# EAGLE design node4 (EAGLE 5.10)
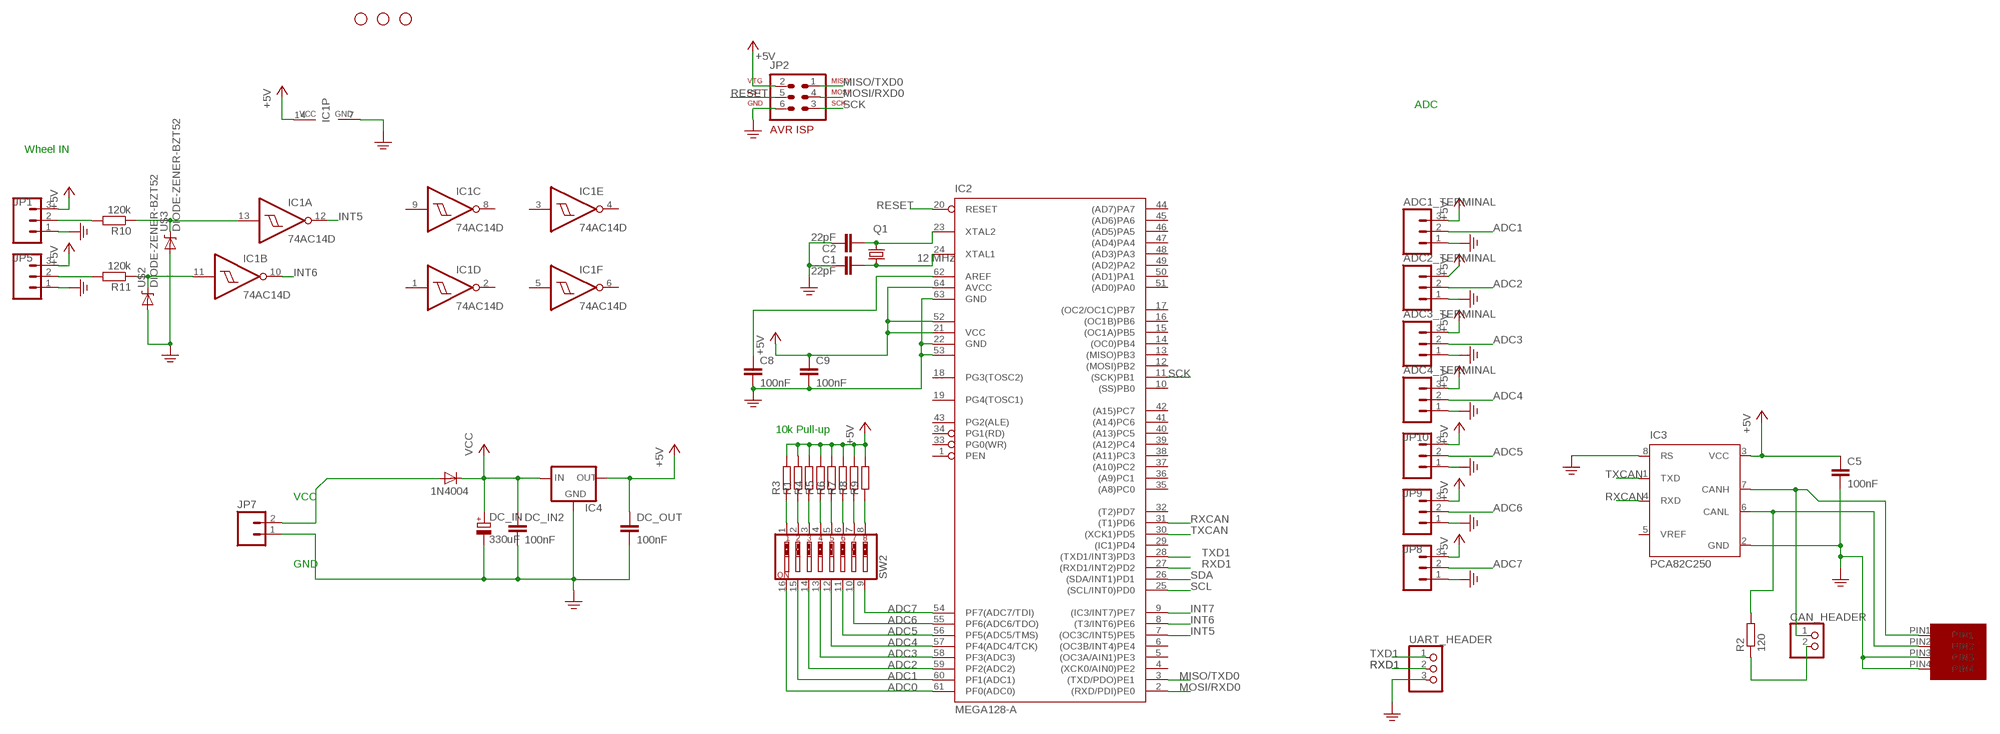
[diagram p0: schematic, sheet 1]

## Parts
ADC1_TERMINAL  M03SCREW  [SCREWTERMINAL-3.5MM-3]
ADC2_TERMINAL  M03SCREW  [SCREWTERMINAL-3.5MM-3]
ADC3_TERMINAL  M03SCREW  [SCREWTERMINAL-3.5MM-3]
ADC4_TERMINAL  M03SCREW  [SCREWTERMINAL-3.5MM-3]
C1  22pF  C5/2.5  [C5B2.5]
C2  22pF  C5/2.5  [C5B2.5]
C5  100nF  C-EU050-024X044  [C050-024X044]
C8  100nF  C-EU050-024X044  [C050-024X044]
C9  100nF  C-EU050-024X044  [C050-024X044]
CAN_HEADER  PINHD-1X2  [1X02]
DC_IN  330uF  CPOL-EUE15-5AXIAL  [E15-5]
DC_IN2  100nF  C-EU050-024X044  [C050-024X044]
DC_OUT  100nF  C-EU050-024X044  [C050-024X044]
ENSRET  1N4004  [DO41-10]
IC1  74AC14D  [SO14]
IC2  MEGA128-A  [TQFP64]
IC3  PCA82C250  [DIL08]
IC4  V_REG_78XXSIDE  [78XXL]
JP1  M03  [S3B-PH]
JP2  AVR-ISP-6  [AVR-ISP-6]
JP3  STAND-OFF  [STAND-OFF]
JP4  STAND-OFF  [STAND-OFF]
JP5  M03  [S3B-PH]
JP6  STAND-OFF  [STAND-OFF]
JP7  M02-JST-2MM-SMT  [S2B-PH]
JP8  M03  [S3B-PH]
JP9  M03  [S3B-PH]
JP10  M03  [S3B-PH]
Q1  12 MHz  CRYSTALHC49U70  [HC49U70]
R1  R-EU_R0603  [R0603]
R2  120  R-EU_R0603  [R0603]
R3  R-EU_R0603  [R0603]
R4  R-EU_R0603  [R0603]
R5  R-EU_R0603  [R0603]
R6  R-EU_R0603  [R0603]
R7  R-EU_R0603  [R0603]
R8  R-EU_R0603  [R0603]
R9  R-EU_R0603  [R0603]
R10  120k  R-EU_R0603  [R0603]
R11  120k  R-EU_R0603  [R0603]
SW2  SW_DIP-8  [DIPSWITCH-08]
U$1  MICROFIT4  [MICROFIT4SOCK]
U$2  DIODE-ZENER-BZT52  [SOD-323]
U$3  DIODE-ZENER-BZT52  [SOD-323]
UART_HEADER  PINHD-1X3  [1X03]

## Nets
+5V: ADC1_TERMINAL.3 ADC2_TERMINAL.3 ADC3_TERMINAL.3 ADC4_TERMINAL.3 C5.1 C9.1 DC_OUT.1 IC1.14(P:VCC) IC2.21(VCC) IC2.52(VCC1) IC2.64(AVCC) IC3.3(VCC) IC4.OUT JP1.3 JP2.2 JP5.3 JP8.3 JP9.3 JP10.3 R1.2 R3.2 R4.2 R5.2 R6.2 R7.2 R8.2 R9.2
ADC0: IC2.61(PF0(ADC0)) SW2.16
ADC1: ADC1_TERMINAL.2 IC2.60(PF1(ADC1)) SW2.15
ADC2: ADC2_TERMINAL.2 IC2.59(PF2(ADC2)) SW2.14
ADC3: ADC3_TERMINAL.2 IC2.58(PF3(ADC3)) SW2.13
ADC4: ADC4_TERMINAL.2 IC2.57(PF4(ADC4/TCK)) SW2.12
ADC5: IC2.56(PF5(ADC5/TMS)) JP10.2 SW2.11
ADC6: IC2.55(PF6(ADC6/TDO)) JP9.2 SW2.10
ADC7: IC2.54(PF7(ADC7/TDI)) JP8.2 SW2.9
CANJUMP1: CAN_HEADER.1 IC3.7(CANH) U$1.PIN1
CANJUMP2: CAN_HEADER.2 R2.1
INT5: IC1.12(A:O) IC2.7((OC3C/INT5)PE5)
INT6: IC1.10(B:O) IC2.8((T3/INT6)PE6)
INT7: IC2.9((IC3/INT7)PE7)
MISO/TXD0: IC2.3((TXD/PDO)PE1) JP2.1
MOSI/RXD0: IC2.2((RXD/PDI)PE0) JP2.4
N$1: C1.2 IC2.24(XTAL1) Q1.1
N$2: C2.2 IC2.23(XTAL2) Q1.2
N$3: R1.1 SW2.2
N$4: R3.1 SW2.1
N$5: ENSRET.A JP7.2
N$7: R4.1 SW2.3
N$8: JP5.2 R11.2
N$9: JP1.2 R10.2
N$10: C8.1 IC2.62(AREF)
N$12: IC1.11(B:I) R11.1 U$2.1(C)
N$13: IC1.13(A:I) R10.1 U$3.1(C)
N$14: R5.1 SW2.4
N$15: R6.1 SW2.5
N$16: R7.1 SW2.6
N$17: R8.1 SW2.7
N$20: R9.1 SW2.8
N$51: IC3.6(CANL) R2.2 U$1.PIN2
PE: ADC1_TERMINAL.1 ADC2_TERMINAL.1 ADC3_TERMINAL.1 ADC4_TERMINAL.1 C1.1 C2.1 C5.2 C8.2 C9.2 DC_IN2.2 DC_IN.- DC_OUT.2 IC1.7(P:GND) IC2.22(GND) IC2.53(GND1) IC2.63(GND) IC3.2(GND) IC3.8(RS) IC4.GND JP1.1 JP2.6 JP5.1 JP7.1 JP8.1 JP9.1 JP10.1 U$1.PIN3 U$1.PIN4 U$2.2(A) U$3.2(A) UART_HEADER.3
RESET: IC2.20(RESET) JP2.5
RXCAN: IC2.31((T1)PD6) IC3.4(RXD)
RXD1: IC2.27((RXD1/INT2)PD2) UART_HEADER.2
SCK: IC2.11((SCK)PB1) JP2.3
SCL: IC2.25((SCL/INT0)PD0)
SDA: IC2.26((SDA/INT1)PD1)
TXCAN: IC2.30((XCK1)PD5) IC3.1(TXD)
TXD1: IC2.28((TXD1/INT3)PD3) UART_HEADER.1
VCC: DC_IN2.1 DC_IN.+ ENSRET.C IC4.IN
Unconnected: IC1.1(D:I) IC1.2(D:O) IC1.3(E:I) IC1.4(E:O) IC1.5(F:I) IC1.6(F:O) IC1.8(C:O) IC1.9(C:I) IC2.1(PEN) IC2.4((XCK0/AIN0)PE2) IC2.5((OC3A/AIN1)PE3) IC2.6((OC3B/INT4)PE4) IC2.10((SS)PB0) IC2.12((MOSI)PB2) IC2.13((MISO)PB3) IC2.14((OC0)PB4) IC2.15((OC1A)PB5) IC2.16((OC1B)PB6) IC2.17((OC2/OC1C)PB7) IC2.18(PG3(TOSC2)) IC2.19(PG4(TOSC1)) IC2.29((IC1)PD4) IC2.32((T2)PD7) IC2.33(PG0(WR)) IC2.34(PG1(RD)) IC2.35((A8)PC0) IC2.36((A9)PC1) IC2.37((A10)PC2) IC2.38((A11)PC3) IC2.39((A12)PC4) IC2.40((A13)PC5) IC2.41((A14)PC6) IC2.42((A15)PC7) IC2.43(PG2(ALE)) IC2.44((AD7)PA7) IC2.45((AD6)PA6) IC2.46((AD5)PA5) IC2.47((AD4)PA4) IC2.48((AD3)PA3) IC2.49((AD2)PA2) IC2.50((AD1)PA1) IC2.51((AD0)PA0) IC3.5(VREF)

## Notes on the sheet
- ADC
- Wheel IN
- 10k Pull-up
- VCC
- GND

## Library data of the parts
ADC1_TERMINAL ADC2_TERMINAL ADC3_TERMINAL ADC4_TERMINAL = SparkFun:M03: Header 3 Standard 3-pin 0.1" header. Use with straight break away headers (SKU : PRT-00116), right angle break away headers (PRT-00553), swiss pins (PRT-00743), machine pins (PRT-00117), and female headers (PRT-00115). Molex polarized connector foot print use with SKU : PRT-08232 with associated crimp pins and housings.
C1 C2 = capacitor-wima:C: CAPACITOR naming: grid - package width
C5 C8 C9 DC_IN2 DC_OUT = rcl:C-EU: CAPACITOR, European symbol
CAN_HEADER = pinhead:PINHD-1X2: PIN HEADER
DC_IN = rcl:CPOL-EU: POLARIZED CAPACITOR, European symbol
ENSRET = diode:1N4004: DIODE general purpose rectifier, 1 A
IC1 = 74xx-eu:74*14: Hex schmitt trigger INVERTER
IC2 = atmel:MEGA128: MICROCONTROLLER 128 Kbytes FLASH 4 Kbytes SRAM 4 Kbytes EEPROM DUAL USART 8-channel 10 bit ADC Source: avr.lbr
IC3 = micro-philips:PCA82C250: CAN CONTROLLER INTERFACE
IC4 = SparkFun:V_REG_78XX: Voltage Regulator Standard 7805 5V regulator. IGO (Input Ground Output). Spark Fun Electronics SKU : COM-00107
JP1 JP5 JP8-JP10 = unicorn_v2:M03: Header 2 Standard 2-pin 0.1" header. Use with straight break away headers (SKU : PRT-00116), right angle break away headers (PRT-00553), swiss pins (PRT-00743), machine pins (PRT-00117), and female headers (PRT-00115). Molex polarized connector foot print use with SKU : PRT-08233 with associated crimp pins and housings.
JP2 = avr-5:AVR-ISP-6: AVR ISP-6 Serial Programming Header
JP3 JP4 JP6 = SparkFun:STAND-OFF: Stand Off This is the mechanical footprint for a #4 phillips button head screw. Use the keepout ring to avoid running the screw head into surrounding components. SKU : PRT-00447
JP7 = unicorn_v2:M02: Header 2 Standard 2-pin 0.1" header. Use with straight break away headers (SKU : PRT-00116), right angle break away headers (PRT-00553), swiss pins (PRT-00743), machine pins (PRT-00117), and female headers (PRT-00115). Molex polarized connector foot print use with SKU : PRT-08233 with associated crimp pins and housings.
Q1 = crystal:CRYSTAL: CRYSTAL
R1-R11 = resistor:R-EU_: RESISTOR, European symbol
SW2 = SparkFun:SW_DIP-8: DIP Switch 8 Position Spark Fun Electronics SKU : COM-08034
U$1 = UNICORN:MICROFIT4
U$2 U$3 = SparkFun:DIODE-ZENER: Zener Diode Production Part - 8199 3.4V Zener Voltage
UART_HEADER = pinhead:PINHD-1X3: PIN HEADER

## Board
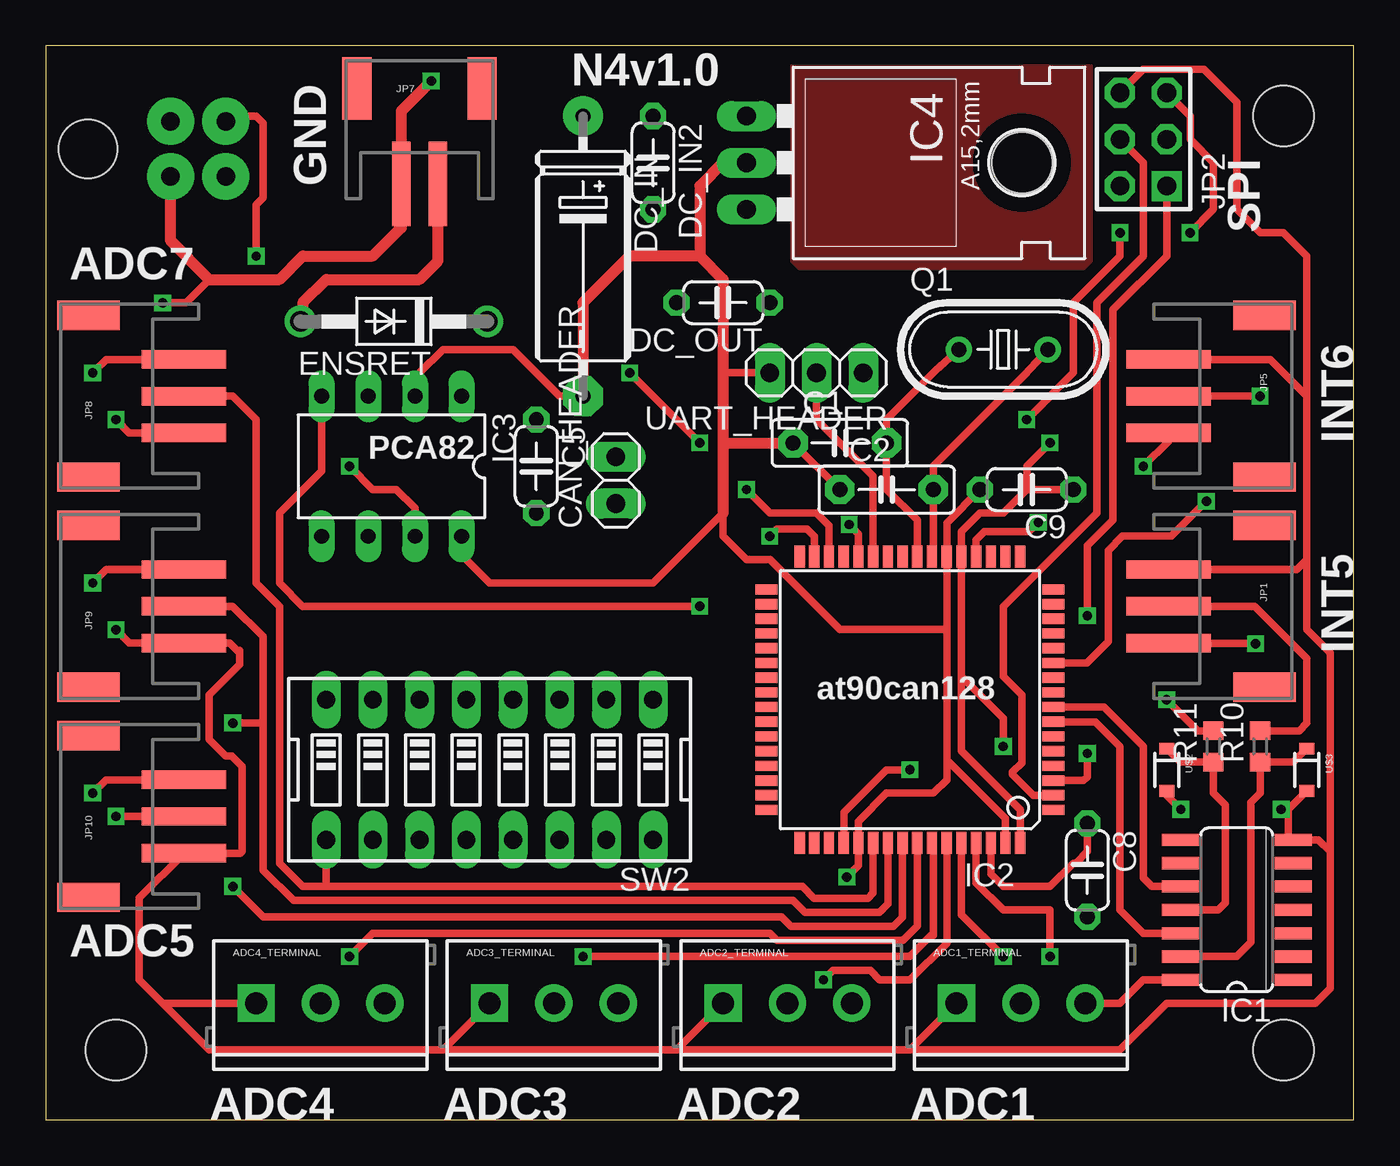
[diagram p1: board, top side]
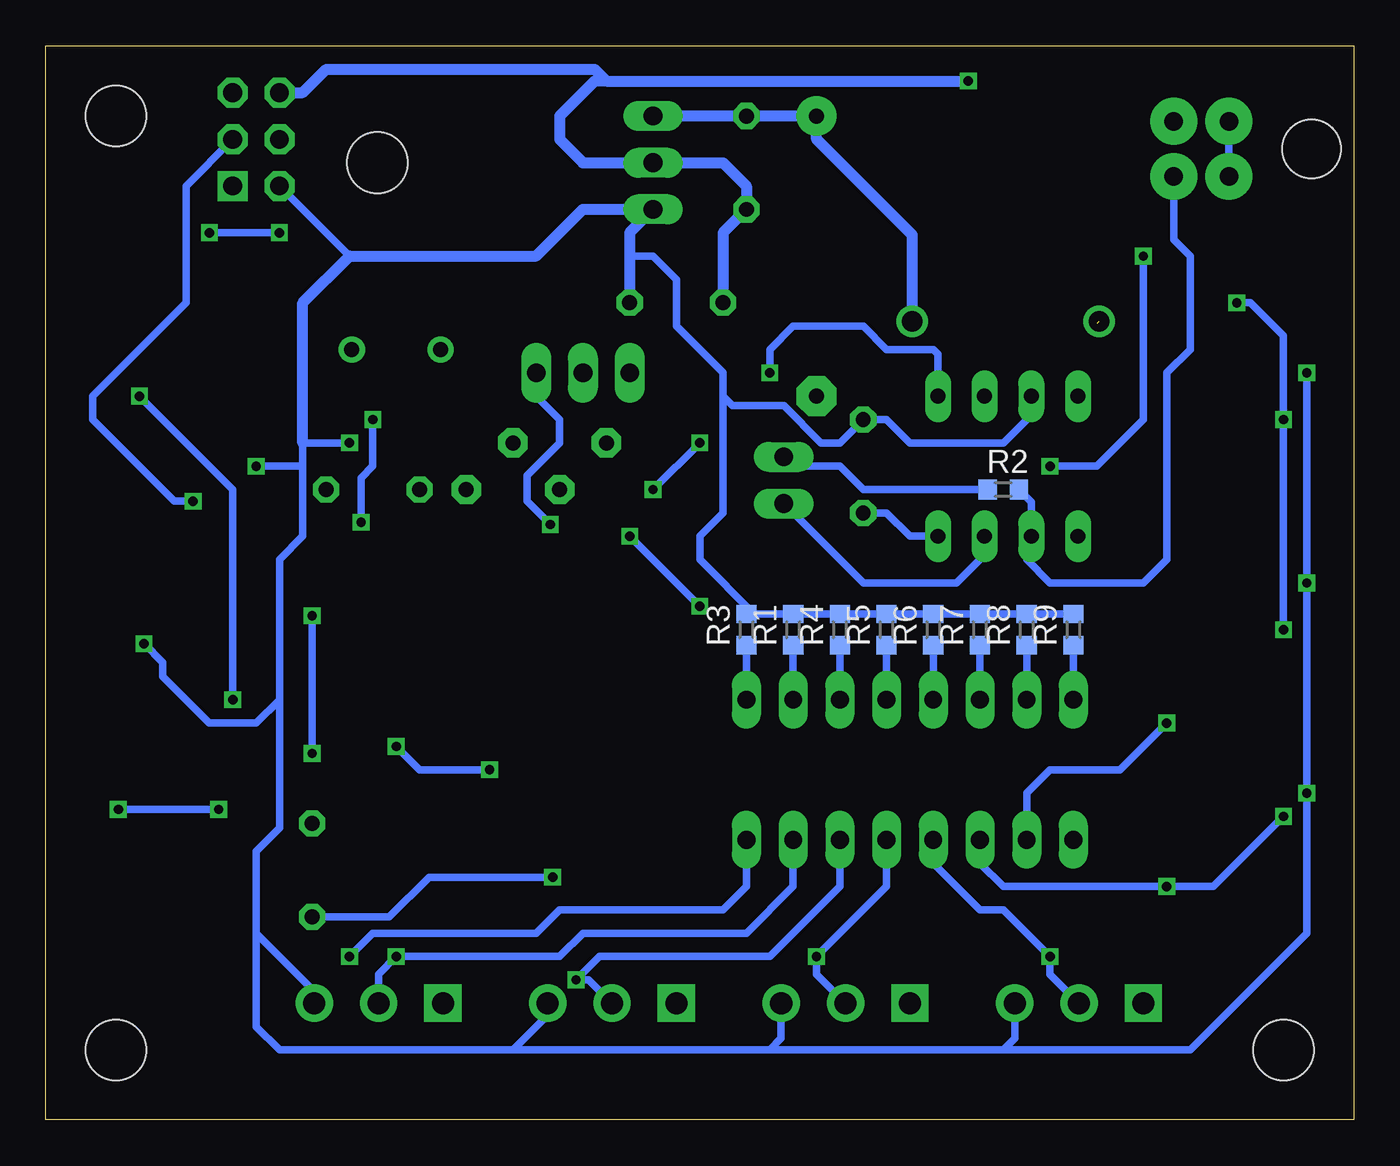
[diagram p2: board, bottom side, seen from below]

Size 71.12 x 58.42 mm. Coordinates in mm from the lower left corner, seen from the top.
Outline: 0,0 71.12,0 71.12,58.42 0,58.42 0,0
Copper layers (1*16): Top 0.035mm / dielectric 1.5mm / Bottom 0.035mm
Design rules "default *": minimum track width 12mil, minimum drill 24mil, track to track 12mil, track to pad 12mil, pad to pad 8mil, via to via 8mil, smd to smd 8mil, copper to edge 40mil, drill to drill 8mil, minimum pad ring 12mil, minimum via ring 8mil, stop-mask expansion 4mil, vias tented up to drill 0mil, thermal gap 10mil

### Footprints (pad centres in the part's own frame; a part is rotated, then mirrored left to right if it is on the bottom)
SCREWTERMINAL-3.5MM-3 = drill 1.2 pad 2.032 square: 1 0,0 | drill 1.2 pad 2.032 round: 2 3.5,0; 3 7,0
C5B2.5 = drill 0.813 pad 1.6 octagon: 1 -2.54,0; 2 2.54,0
C050-024X044 = drill 0.813 octagon: 1 -2.54,0; 2 2.54,0
1X02 = drill 1.016 long: 1 -1.27,0; 2 1.27,0
E15-5 = drill 0.813 pad 2.159 round: + -7.62,0 | drill 0.813 pad 2.159 octagon: - 7.62,0
DO41-10 = drill 1.118 round: A 5.08,0; C -5.08,0
SO14 = smd 0.66 x 2.032: 1 -3.81,-3.073; 2 -2.54,-3.073; 3 -1.27,-3.073; 4 0,-3.073; 5 1.27,-3.073; 6 2.54,-3.073; 7 3.81,-3.073; 8 3.81,3.073; 9 2.54,3.073; 10 1.27,3.073; 11 0,3.073; 12 -1.27,3.073; 13 -2.54,3.073; 14 -3.81,3.073
TQFP64 = smd 1.194 x 0.559: 1 -7.8,6; 2 -7.8,5.2; 3 -7.8,4.4; 4 -7.8,3.6; 5 -7.8,2.8; 6 -7.8,2; 7 -7.8,1.2; 8 -7.8,0.4; 9 -7.8,-0.4; 10 -7.8,-1.2; 11 -7.8,-2; 12 -7.8,-2.8; 13 -7.8,-3.6; 14 -7.8,-4.4; 15 -7.8,-5.2; 16 -7.8,-6; 33 7.8,-6; 34 7.8,-5.2; 35 7.8,-4.4; 36 7.8,-3.6; 37 7.8,-2.8; 38 7.8,-2; 39 7.8,-1.2; 40 7.8,-0.4; 41 7.8,0.4; 42 7.8,1.2; 43 7.8,2; 44 7.8,2.8; 45 7.8,3.6; 46 7.8,4.4; 47 7.8,5.2; 48 7.8,6 | smd 0.559 x 1.194: 17 -6,-7.8; 18 -5.2,-7.8; 19 -4.4,-7.8; 20 -3.6,-7.8; 21 -2.8,-7.8; 22 -2,-7.8; 23 -1.2,-7.8; 24 -0.4,-7.8; 25 0.4,-7.8; 26 1.2,-7.8; 27 2,-7.8; 28 2.8,-7.8; 29 3.6,-7.8; 30 4.4,-7.8; 31 5.2,-7.8; 32 6,-7.8; 49 6,7.8; 50 5.2,7.8; 51 4.4,7.8; 52 3.6,7.8; 53 2.8,7.8; 54 2,7.8; 55 1.2,7.8; 56 0.4,7.8; 57 -0.4,7.8; 58 -1.2,7.8; 59 -2,7.8; 60 -2.8,7.8; 61 -3.6,7.8; 62 -4.4,7.8; 63 -5.2,7.8; 64 -6,7.8
DIL08 = drill 0.813 long: 1 -3.81,-3.81; 2 -1.27,-3.81; 3 1.27,-3.81; 4 3.81,-3.81; 5 3.81,3.81; 6 1.27,3.81; 7 -1.27,3.81; 8 -3.81,3.81
78XXL = drill 1.016 long: GND 0,-3.81; IN -2.54,-3.81; OUT 2.54,-3.81 | hole 3.302: 0,11.176
S3B-PH = smd 1 x 4.6: 1 -2,-2.43; 2 0,-2.43; 3 2,-2.43 | smd 1.6 x 3.4: NC1 -4.4,2.77; NC2 4.4,2.77
AVR-ISP-6 = drill 1.016 square: 1 -2.54,-1.27 | drill 1.016 octagon: 2 -2.54,1.27; 3 0,-1.27; 4 0,1.27; 5 2.54,-1.27; 6 2.54,1.27
STAND-OFF = hole 3.302: 0,0
S2B-PH = smd 1 x 4.6: 1 -1,-3.7; 2 1,-3.7 | smd 1.6 x 3.4: NC1 -3.4,1.5; NC2 3.4,1.5
HC49U70 = drill 0.813 round: 1 -2.413,0; 2 2.413,0
R0603 = smd 1 x 1.1: 1 -0.85,0; 2 0.85,0
DIPSWITCH-08 = drill 0.97 long: 1 -8.89,-3.81; 2 -6.35,-3.81; 3 -3.81,-3.81; 4 -1.27,-3.81; 5 1.27,-3.81; 6 3.81,-3.81; 7 6.35,-3.81; 8 8.89,-3.81; 9 8.89,3.81; 10 6.35,3.81; 11 3.81,3.81; 12 1.27,3.81; 13 -1.27,3.81; 14 -3.81,3.81; 15 -6.35,3.81; 16 -8.89,3.81
MICROFIT4SOCK = drill 1 pad 2.54 round: PIN1 -2,0; PIN2 1,0; PIN3 -2,-3; PIN4 1,-3 | hole 3.2: -0.5,-7.5
SOD-323 = smd 0.63 x 0.83: 1 -1.15,0; 2 1.15,0
1X03 = drill 1.016 long: 1 -2.54,0; 2 0,0; 3 2.54,0

### Placement (x,y rotation side)
ADC1_TERMINAL  49.53,6.35 0 top
ADC2_TERMINAL  36.83,6.35 0 top
ADC3_TERMINAL  24.13,6.35 0 top
ADC4_TERMINAL  11.43,6.35 0 top
C1  43.18,36.83 0 top
C2  45.72,34.29 0 top
C5  26.67,35.56 270 top
C8  56.64,13.59 270 top
C9  53.34,34.29 180 top
CAN_HEADER  30.99,34.8 90 top
DC_IN  29.21,46.99 270 top
DC_IN2  33.02,52.07 270 top
DC_OUT  36.83,44.45 180 top
ENSRET  18.92,43.43 180 top
IC1  64.77,11.43 90 top
IC2  46.99,22.86 180 top
IC3  18.8,35.56 180 top
IC4  41.91,52.07 270 top
JP1  63.5,27.94 270 top
JP2  59.69,53.34 90 top
JP3  3.81,3.81 0 top
JP4  67.31,3.81 0 top
JP5  63.5,39.37 270 top
JP6  67.31,54.61 0 top
JP7  20.32,54.61 0 top
JP8  5.08,39.37 90 top
JP9  5.08,27.94 90 top
JP10  5.08,16.51 90 top
Q1  52.07,41.91 0 top
R1  30.48,26.67 90 bottom
R2  19.05,34.29 0 bottom
R3  33.02,26.67 90 bottom
R4  27.94,26.67 90 bottom
R5  25.4,26.67 90 bottom
R6  22.86,26.67 90 bottom
R7  20.32,26.67 90 bottom
R8  17.78,26.67 90 bottom
R9  15.24,26.67 90 bottom
R10  66.04,20.32 90 top
R11  63.5,20.32 90 top
SW2  24.13,19.05 180 top
U$1  9.78,52.32 270 top
U$2  60.96,19.05 270 top
U$3  68.58,19.05 270 top
UART_HEADER  41.91,40.64 180 top

### Tracks (layer width: path | path; a pad name or v marks a point on that pad's centre or on a via)
+5V  (via drill 0.51)
  Top 0.406: 53.34,34.29 52.07,33.02 50.8,33.02 49.79,32.01 IC2.21 49.79,24.13 | 53.34,34.29 C9.1 | 53.34,34.29 53.34,35.56 v54.61,36.83 | IC2.64 52.99,16.86 49.79,20.06 49.79,24.13 | IC2.52 43.39,16.72 45.72,19.05 v46.99,19.05 | v52.07,20.32 52.07,21.85 49.79,24.13 | IC1.14 59.69,7.62 58.42,6.35 ADC1_TERMINAL.3 | v65.79,25.91 61.1,25.91 JP1.3 | JP5.3 61.07,36.94 v59.69,35.56 | JP8.3 3.27,41.37 v2.54,40.64 | JP9.3 3.27,29.94 v2.54,29.21 | JP10.3 3.27,18.51 v2.54,17.78
  Bottom 0.406: IC3.3 17.78,39.12 17.78,38.1 19.05,36.83 24.13,36.83 25.4,38.1 C5.1 27.94,36.83 28.96,36.83 30.99,38.86 33.78,38.86 34.29,39.37 | v54.61,36.83 57.15,36.83 57.15,35.56 | v46.99,19.05 50.8,19.05 v52.07,20.32 | ADC1_TERMINAL.3 56.53,7 59.69,10.16 | 59.69,10.16 59.69,14.61 58.42,15.88 58.42,22.86 | ADC2_TERMINAL.3 43.83,5.7 45.72,3.81 | 45.72,3.81 58.42,3.81 59.69,5.08 59.69,10.16 | ADC3_TERMINAL.3 31.13,4.43 31.75,3.81 | 31.75,3.81 45.72,3.81 | ADC4_TERMINAL.3 18.43,4.43 19.05,3.81 | 19.05,3.81 31.75,3.81 | 19.05,3.81 8.89,3.81 2.54,10.16 v2.54,17.78 v2.54,29.21 v2.54,40.64 | R3.2 R1.2 R4.2 R5.2 R6.2 R7.2 R8.2 R9.2 32.6,27.52 35.56,30.48 35.56,31.75 34.29,33.02 34.29,39.37 | 39.37,46.99 38.1,46.99 36.83,45.72 36.83,43.18 34.29,40.64 34.29,39.37 | 57.15,35.56 57.15,31.75 58.42,30.48 58.42,22.86 | 54.61,46.99 JP2.2 | 58.42,22.86 59.69,21.59 62.23,21.59 64.77,24.13 64.77,24.89 v65.79,25.91 | 57.15,35.56 v59.69,35.56
  Bottom 0.61: DC_OUT.1 39.37,46.99 39.37,48.26 IC4.OUT 41.91,49.53 44.45,46.99 54.61,46.99 57.15,44.45 57.15,36.83
ADC0  (via drill 0.51)
  Top 0.406: IC2.61 50.59,12.91 52.07,11.43 54.61,11.43 v54.61,8.89
  Bottom 0.406: SW2.16 33.02,12.7 34.29,11.43 43.18,11.43 44.45,10.16 53.34,10.16 v54.61,8.89
ADC1  (via drill 0.51)
  Top 0.406: IC2.60 49.79,11.17 v52.07,8.89
  Bottom 0.406: ADC1_TERMINAL.2 53.03,7.93 v52.07,8.89 43.18,8.89 41.91,10.16 33.02,10.16 30.48,12.7 SW2.15
ADC2  (via drill 0.51)
  Top 0.406: IC2.59 48.99,9.62 46.99,7.62 45.34,7.62 44.83,8.13 42.8,8.13 v42.29,7.62
  Bottom 0.406: ADC2_TERMINAL.2 41.6,7.62 v42.29,7.62 41.02,8.89 31.75,8.89 27.94,12.7 SW2.14
ADC3  (via drill 0.51)
  Top 0.406: IC2.58 48.26,15.06 48.26,10.03 48.13,10.03 46.99,8.89 v29.21,8.89
  Bottom 0.406: ADC3_TERMINAL.2 29.21,7.93 v29.21,8.89 25.4,12.7 SW2.13
ADC4  (via drill 0.51)
  Top 0.406: v16.51,8.89 17.78,10.16 39.37,10.16 39.75,9.78 46.61,9.78 47.39,10.56 IC2.57
  Bottom 0.406: ADC4_TERMINAL.2 16.51,7.93 v16.51,8.89 19.05,11.43 20.32,11.43 22.86,13.97 SW2.12
ADC5  (via drill 0.51)
  Top 0.406: IC2.56 46.59,11.03 46.1,10.54 40.51,10.54 40.01,11.05 11.81,11.05 v10.16,12.7 | v3.81,16.51 JP10.2
  Bottom 0.406: SW2.11 20.32,13.97 19.05,12.7 v10.16,12.7 7.62,12.7 v3.81,16.51
ADC6  (via drill 0.51)
  Top 0.406: IC2.55 45.79,11.75 45.34,11.3 41.27,11.3 40.64,11.94 13.46,11.94 11.81,13.59 11.81,21.59 | JP9.2 10.16,27.94 11.81,26.29 11.81,21.59 | 11.81,21.59 v10.16,21.59
  Bottom 0.406: SW2.10 17.78,17.78 16.51,19.05 12.7,19.05 v10.16,21.59
ADC7
  Top 0.406: IC2.54 44.99,12.35 44.7,12.06 41.78,12.06 41.15,12.7 15.24,12.7 | 15.24,12.7 13.97,12.7 12.7,13.97 12.7,27.94 11.43,29.21 11.43,38.1 10.16,39.37 JP8.2 | 15.24,12.7 SW2.9
CANJUMP1  (via drill 0.51)
  Top 0.406: IC3.7 20.07,33.27 19.05,34.29 17.78,34.29 v16.51,35.56 | U$1.PIN1 10.06,54.61 11.43,54.61 11.81,54.23 11.81,50.16 11.43,49.78 v11.43,46.99
  Bottom 0.406: IC3.7 20.07,30.73 21.59,29.21 26.67,29.21 CAN_HEADER.1 | v16.51,35.56 13.97,35.56 11.43,38.1 v11.43,46.99
CANJUMP2
  Bottom 0.406: R2.1 26.67,34.29 27.94,35.56 30.48,35.56 CAN_HEADER.2
INT5
  Top 0.406: IC1.12 59.69,10.16 58.42,11.43 58.42,20.32 57.08,21.66 IC2.7
INT6
  Top 0.406: IC2.8 57.55,22.46 59.69,20.32 59.69,13.16 60.15,12.7 IC1.10
MISO/TXD0  (via drill 0.51)
  Top 0.406: JP2.1 60.96,46.99 58.04,44.07 58.04,32.64 56.64,31.24 v56.64,27.43 | IC2.3 56.43,18.46 56.64,18.67 v56.64,19.94
  Bottom 0.406: v56.64,19.94 v56.64,27.43
MOSI/RXD0
  Top 0.406: IC2.2 53.71,17.66 52.58,18.8 52.58,18.92 53.09,19.43 53.09,23.11 52.07,24.13 52.07,27.94 57.15,33.02 57.15,44.45 59.69,46.99 59.69,52.07 JP2.4
N$1
  Top 0.406: IC2.24 47.39,32.62 45.72,34.29 C1.2 45.72,38.1 48.39,40.77 Q1.1
N$2
  Top 0.406: IC2.23 48.26,30.73 C2.2 48.26,35.56 53.21,40.51 Q1.2
N$3
  Bottom 0.406: SW2.2 R1.1
N$4
  Bottom 0.406: SW2.1 R3.1
N$5  (1 unrouted)
  Top 0.61: 13.97,43.31 13.97,44.45 15.24,45.72 20.32,45.72 21.32,46.72 JP7.2
N$6
  pour Top: 40.64,57.15 40.64,57.4 41.15,57.91 56.26,57.91 56.77,57.4 56.77,46.74 56.39,46.35 41.02,46.35 40.64,46.74
N$7
  Bottom 0.406: SW2.3 R4.1
N$8  (via drill 0.51)
  Top 0.406: R11.2 62.65,21.17 v60.96,22.86 | v66.04,39.37 JP5.2
  Bottom 0.406: v60.96,22.86 60.96,34.29 v66.04,39.37
N$9
  Top 0.406: R10.2 68.16,21.17 68.58,21.59 68.58,25.1 65.74,27.94 JP1.2
N$10
  Top 0.406: IC2.62 51.39,13.38 52.07,12.7 54.61,12.7 55.88,13.97 56.01,13.97 56.64,14.61 C8.1
N$12
  Top 0.406: IC1.11 63.75,11.43 64.14,11.81 64.14,17.14 63.5,17.78 R11.1 61.69,19.47 U$2.1
N$13
  Top 0.406: IC1.13 64.77,8.89 65.53,9.65 65.53,17.27 66.04,17.78 R10.1 67.85,19.47 U$3.1
N$14
  Bottom 0.406: SW2.4 R5.1
N$15
  Bottom 0.406: SW2.5 R6.1
N$16
  Bottom 0.406: SW2.6 R7.1
N$17
  Bottom 0.406: SW2.7 R8.1
N$20
  Bottom 0.406: SW2.8 R9.1
N$51
  Bottom 0.406: R2.2 17.53,33.62 IC3.6 17.78,31.5 17.78,30.48 16.51,29.21 11.43,29.21 10.16,30.48 10.16,40.64 8.89,41.91 8.89,46.99 9.78,47.88 U$1.PIN2
PE  (via drill 0.51)
  Top 0.406: C1.1 C2.1 | C9.2 48.99,32.48 IC2.22 48.99,26.67 | IC2.63 52.19,16.39 48.99,19.59 | 48.99,26.67 48.99,19.59 | 48.99,19.59 48.99,18.51 48.26,17.78 45.72,17.78 44.19,16.25 IC2.53 44.19,13.84 v43.56,13.21 | 48.99,26.67 43.18,26.67 39.37,30.48 38.1,30.48 36.83,31.75 36.83,33.02 33.02,29.21 24.13,29.21 22.61,30.73 IC3.8 | 36.83,40.64 UART_HEADER.3 | 6.35,6.35 ADC4_TERMINAL.1 | 21.59,3.81 ADC3_TERMINAL.1 | 21.59,3.81 8.89,3.81 6.35,6.35 | 34.29,3.81 ADC2_TERMINAL.1 | 21.59,3.81 34.29,3.81 | 46.99,3.81 ADC1_TERMINAL.1 | 34.29,3.81 46.99,3.81 | DC_IN.- 27.94,39.37 25.4,41.91 21.59,41.91 20.32,40.64 20.32,39.62 IC3.2 | 46.99,3.81 58.42,3.81 60.96,6.35 69.04,6.35 69.85,7.16 69.85,14.61 | U$2.2 60.96,17.65 v61.72,16.89 | 67.57,16.89 v67.18,16.89 | 67.57,16.89 U$3.2 | 67.57,16.89 67.57,15.51 IC1.7 69.22,15.24 69.85,14.61 | JP5.1 66.58,41.37 68.58,39.37 | 68.58,30.48 68.58,26.67 69.85,25.4 69.85,14.61 | 68.58,30.48 68.58,39.37 | JP1.1 68.04,29.94 68.58,30.48 | 6.35,6.35 5.08,7.62 5.08,12.08 JP10.1 10.57,14.51 10.67,14.61 10.67,19.24 10.1,19.81 9.78,19.81 8.89,20.7 8.89,23.11 10.54,24.77 10.54,25.4 | JP8.1 4.54,37.37 v3.81,38.1 | v3.81,26.67 4.54,25.94 JP9.1 10,25.94 10.54,25.4 | 10.54,25.4 10.54,25.53 | JP2.6 59.69,57.15 62.97,57.15 64.77,55.35 64.77,49.53 66.04,48.26 67.31,48.26 68.58,46.99 68.58,39.37 | v6.35,44.45 7.62,44.45 8.89,45.72
  Top 0.61: IC4.GND 36.83,52.07 35.56,50.8 35.56,46.99 | 35.56,46.99 36.83,45.72 36.83,40.64 36.83,36.83 | 36.83,36.83 C1.1 | 36.83,36.83 36.83,33.02 | DC_IN.- 29.21,44.45 31.75,46.99 35.56,46.99 | v20.95,56.52 19.32,54.88 JP7.1 19.32,48.53 17.78,46.99 13.97,46.99 12.7,45.72 8.89,45.72 6.78,47.83 U$1.PIN4
  Bottom 0.406: C5.2 25.4,33.02 24.13,31.75 IC3.8 | v43.56,13.21 50.29,13.21 52.45,11.05 C8.2 | U$1.PIN4 U$1.PIN3 | v67.18,16.89 v61.72,16.89 | v6.35,44.45 5.61,44.45 3.81,42.65 v3.81,38.1 v3.81,26.67
  Bottom 0.61: DC_OUT.2 34.29,48.26 DC_IN2.2 33.02,50.8 34.29,52.07 IC4.GND 41.91,52.07 43.18,53.34 43.18,54.61 41.27,56.52 40.64,56.52 | JP2.6 57.15,55.88 55.88,57.15 41.27,57.15 40.64,56.52 | 40.64,56.52 v20.95,56.52
RESET  (via drill 0.51)
  Top 0.406: IC2.20 50.59,31.54 51.05,32 53.47,32 v53.98,32.51 | v53.34,38.1 55.88,40.64 55.88,44.45 58.42,46.99 v58.42,48.26 | v62.23,48.26 63.5,49.53 63.5,52.07 62.23,53.34 62.23,54.61 JP2.5
  Bottom 0.406: v53.98,32.51 53.98,34.92 53.34,35.56 v53.34,38.1 | v58.42,48.26 v62.23,48.26
RXCAN  (via drill 0.51)
  Top 0.406: IC3.4 14.99,35.31 12.7,33.02 12.7,29.21 13.97,27.94 v35.56,27.94 | IC2.31 41.79,31.74 41.4,32.13 39.75,32.13 v39.37,31.75
  Bottom 0.406: v35.56,27.94 v39.37,31.75
RXD1
  Top 0.406: UART_HEADER.2 41.91,38.1 44.99,35.02 IC2.27
SCK  (via drill 0.51)
  Top 0.406: IC2.11 56.61,24.86 57.78,26.04 57.78,30.99 58.55,31.75 61.21,31.75 v63.12,33.66
  Bottom 0.406: v63.12,33.66 64.14,33.66 68.58,38.1 68.58,39.37 63.5,44.45 63.5,50.8 JP2.3
TXCAN  (via drill 0.51)
  Top 0.406: IC2.30 42.59,32.34 41.91,33.02 39.37,33.02 v38.1,34.29 | v31.75,40.64 v35.56,36.83
  Bottom 0.406: IC3.1 22.61,41.66 22.86,41.91 25.4,41.91 26.67,43.18 30.48,43.18 31.75,41.91 v31.75,40.64 | v35.56,36.83 v38.1,34.29
TXD1  (via drill 0.51)
  Top 0.406: IC2.28 44.19,31.88 v43.69,32.38
  Bottom 0.406: UART_HEADER.1 44.45,39.37 43.18,38.1 43.18,36.83 44.96,35.05 44.96,33.66 v43.69,32.38
VCC
  Bottom 0.61: IC4.IN DC_IN2.1 DC_IN.+ 29.21,53.34 24,48.13 ENSRET.C

### Text on the board
tPlace: N4v1.0 | GND | SPI | ADC7 | INT6 | PCA82 | INT5 | at90can128 | ADC5 | ADC4 | ADC3 | ADC2 | ADC1